# Altium schematic sheet IRReceiver.SchDoc
size A
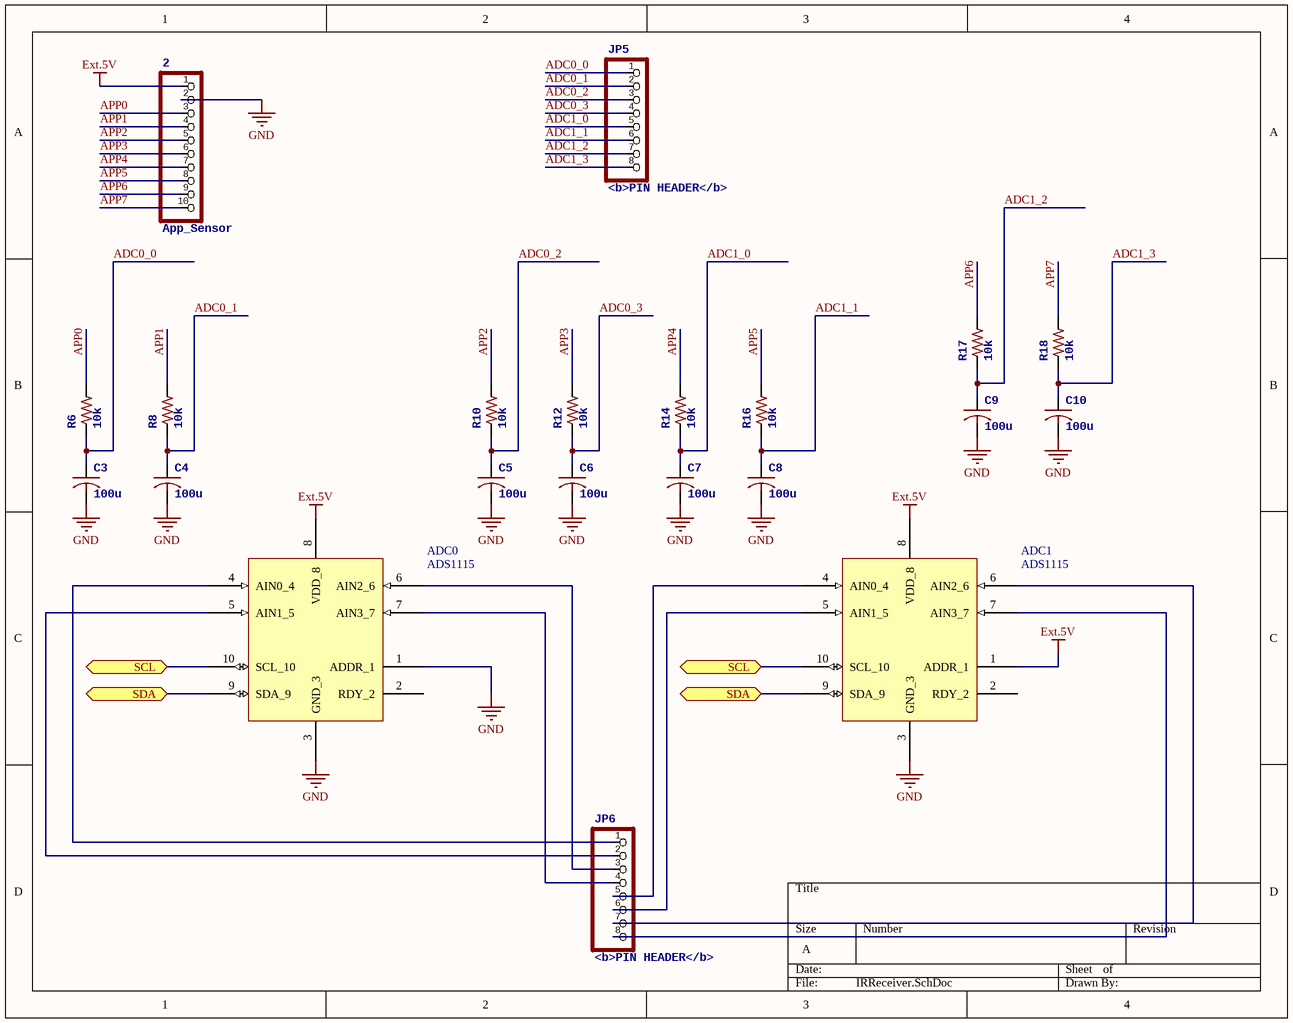
[diagram p0: IRReceiver.SchDoc]

## Parts
2  App_Sensor  [1X10-BIG]
ADC0  ADS1115  [10-VSSOP]
ADC1  ADS1115  [10-VSSOP]
C3  100u  [C0805]
C4  100u  [C0805]
C5  100u  [C0805]
C6  100u  [C0805]
C7  100u  [C0805]
C8  100u  [C0805]
C9  100u  [C0805]
C10  100u  [C0805]
JP5  <b>PIN HEADER</b>  [1X08-BIG]
JP6  <b>PIN HEADER</b>  [1X08-BIG]
R6  10k  [R0805]
R8  10k  [R0805]
R10  10k  [R0805]
R12  10k  [R0805]
R14  10k  [R0805]
R16  10k  [R0805]
R17  10k  [R0805]
R18  10k  [R0805]

## Ports
SCL, SDA

## Nets
Ext.5V: 2.1 ADC0.8(VDD_8) ADC1.1(ADDR_1) ADC1.8(VDD_8)
GND: 2.2 ADC0.1(ADDR_1) ADC0.3(GND_3) ADC1.3(GND_3) C3.2 C4.2 C5.2 C6.2 C7.2 C8.2 C9.2 C10.2
ADC0_0: C3.1 JP5.1 R6.1
ADC0_1: C4.1 JP5.2 R8.1
ADC0_2: C5.1 JP5.3 R10.1
ADC0_3: C6.1 JP5.4 R12.1
ADC1_0: C7.1 JP5.5 R14.1
ADC1_1: C8.1 JP5.6 R16.1
ADC1_2: C9.1 JP5.7 R17.1
ADC1_3: C10.1 JP5.8 R18.1
APP0: 2.3 R6.2
APP1: 2.4 R8.2
APP2: 2.5 R10.2
APP3: 2.6 R12.2
APP4: 2.7 R14.2
APP5: 2.8 R16.2
APP6: 2.9 R17.2
APP7: 2.10 R18.2
SCL: ADC0.10(SCL_10) ADC1.10(SCL_10) ; port SCL
SDA: ADC0.9(SDA_9) ADC1.9(SDA_9) ; port SDA
NetADC0_4: ADC0.4(AIN0_4) JP6.1
NetADC0_5: ADC0.5(AIN1_5) JP6.2
NetADC0_6: ADC0.6(AIN2_6) JP6.3
NetADC0_7: ADC0.7(AIN3_7) JP6.4
NetADC1_4: ADC1.4(AIN0_4) JP6.5
NetADC1_5: ADC1.5(AIN1_5) JP6.6
NetADC1_6: ADC1.6(AIN2_6) JP6.7
NetADC1_7: ADC1.7(AIN3_7) JP6.8

Not connected (* = marked no-connect by the designer): ADC0 2(RDY_2); ADC1 2(RDY_2)

## Library data of the parts
2 = PINHD-1X10
ADC0 ADC1 = ADS1115: vendor: TI
C3-C10 = C-USC0805
JP5 JP6 = PINHD-1X8BIG
R6 R8 R10 R12 R14 R16-R18 = R-US_R0805